# EAGLE design GameBoy-DMG-Buttons (EAGLE 7.1.0)
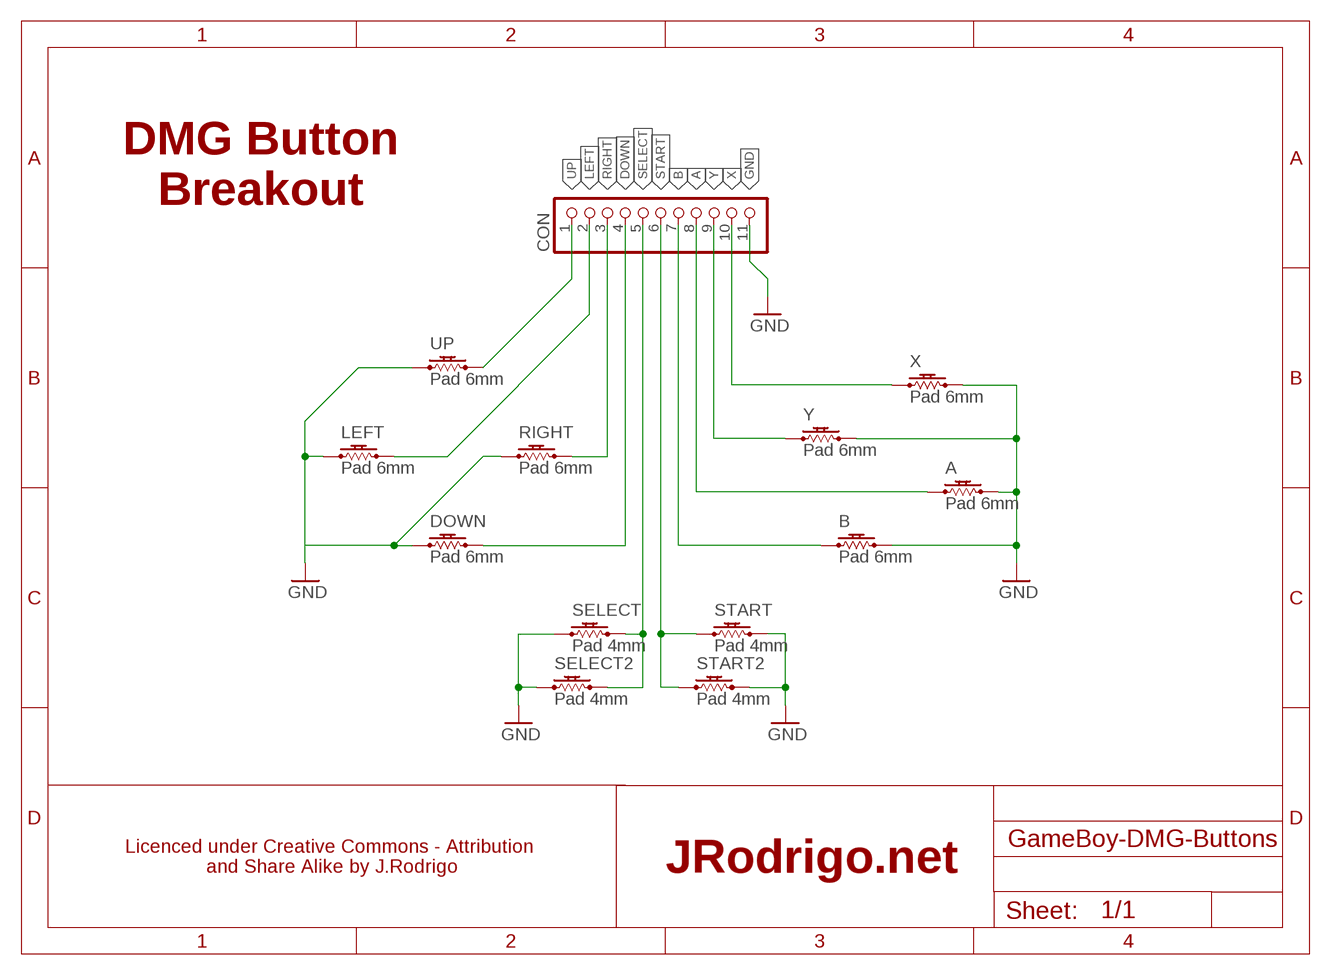
[diagram p0: schematic, sheet 1]

## Parts
A  Pad 6mm  BUTTON_PAD_6MM  [BUTTON_PAD-D6MM]
B  Pad 6mm  BUTTON_PAD_6MM  [BUTTON_PAD-D6MM]
CON  PINHD-1X11  [1X11]
DOWN  Pad 6mm  BUTTON_PAD_6MM  [BUTTON_PAD-D6MM]
LEFT  Pad 6mm  BUTTON_PAD_6MM  [BUTTON_PAD-D6MM]
RIGHT  Pad 6mm  BUTTON_PAD_6MM  [BUTTON_PAD-D6MM]
SELECT  Pad 4mm  BUTTON_PAD_4MM  [BUTTON_PAD-D4MM]
SELECT2  Pad 4mm  BUTTON_PAD_4MM  [BUTTON_PAD-D4MM]
START  Pad 4mm  BUTTON_PAD_4MM  [BUTTON_PAD-D4MM]
START2  Pad 4mm  BUTTON_PAD_4MM  [BUTTON_PAD-D4MM]
UP  Pad 6mm  BUTTON_PAD_6MM  [BUTTON_PAD-D6MM]
X  Pad 6mm  BUTTON_PAD_6MM  [BUTTON_PAD-D6MM]
Y  Pad 6mm  BUTTON_PAD_6MM  [BUTTON_PAD-D6MM]

## Nets
A: A.P1 CON.8
B: B.P1 CON.7
DOWN: CON.4 DOWN.P2
GND: A.P2 B.P2 CON.11 DOWN.P1 LEFT.P1 RIGHT.P1 SELECT2.P1 SELECT.P1 START2.P2 START.P2 UP.P1 X.P2 Y.P2
LEFT: CON.2 LEFT.P2
RIGHT: CON.3 RIGHT.P2
SELECT: CON.5 SELECT2.P2 SELECT.P2
START: CON.6 START2.P1 START.P1
UP: CON.1 UP.P2
X: CON.10 X.P1
Y: CON.9 Y.P1

## Notes on the sheet
- DMG Button
  Breakout
- Licenced under Creative Commons - Attribution 
  and Share Alike by J.Rodrigo
- JRodrigo.net

## Library data of the parts
A B DOWN LEFT RIGHT SELECT SELECT2 START START2 UP X Y = jrodrigo:BUTTON_PAD
CON = pinhead:PINHD-1X11: PIN HEADER

## Board
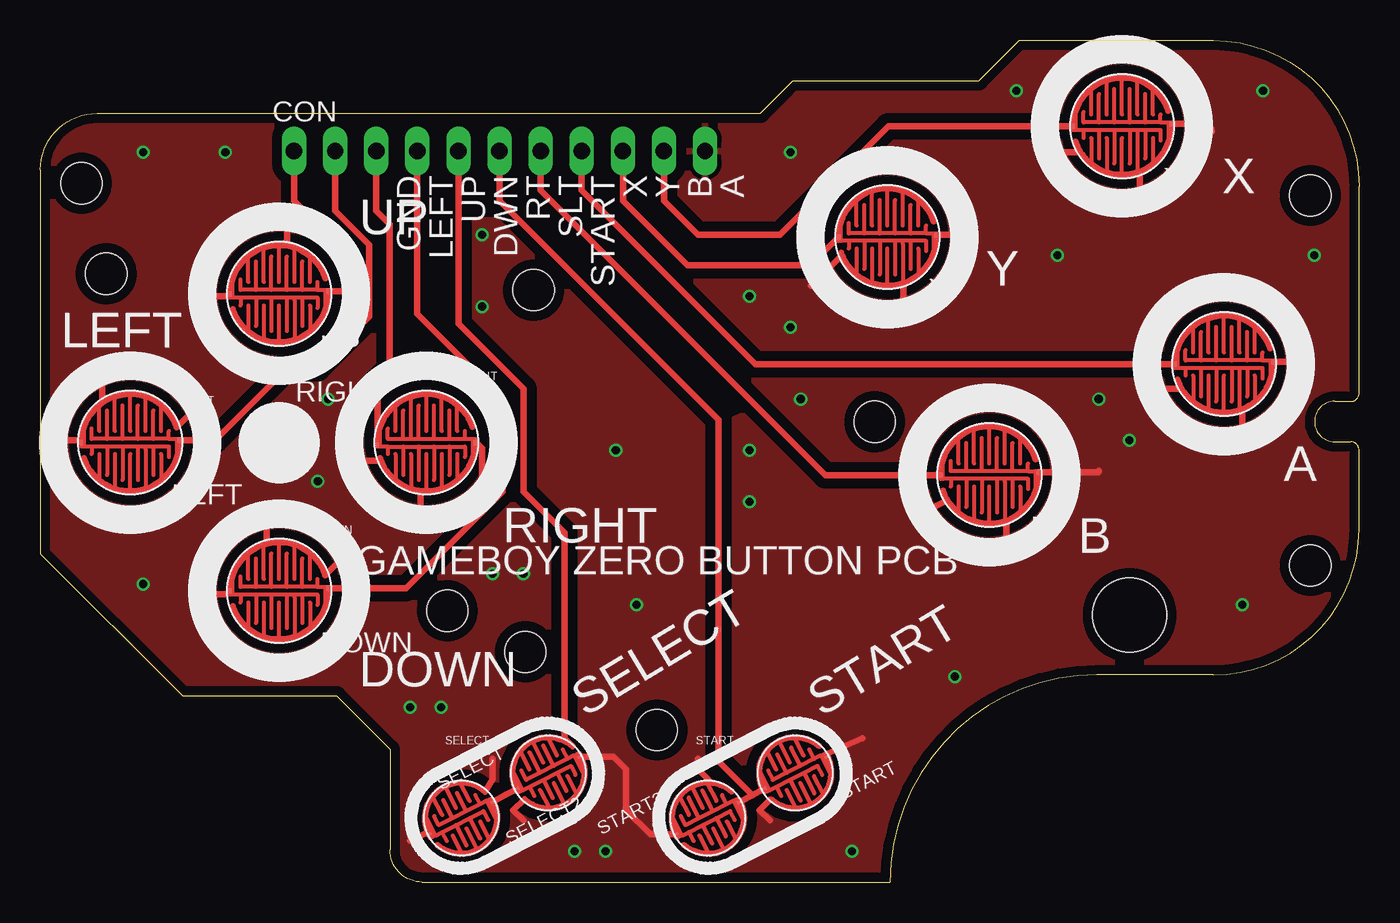
[diagram p1: board, top side]
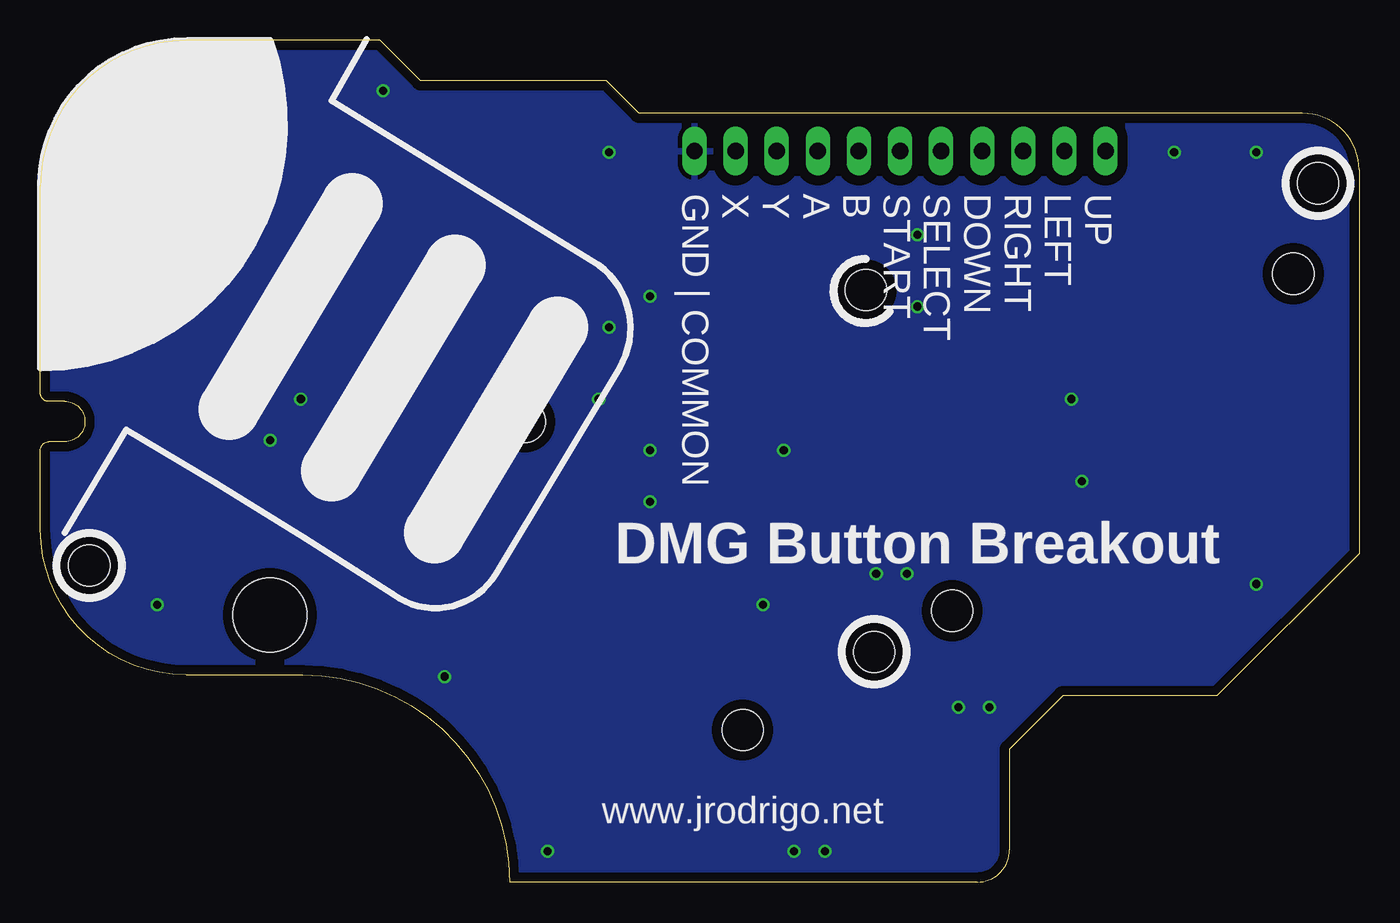
[diagram p2: board, bottom side, seen from below]

Size 81.5 x 52 mm. Coordinates in mm from the lower left corner, seen from the top.
Outline: 0,20.3 8.8,11.5 18.3,11.5 21.6,8.2 21.6,2 arc90 23.6,0 52.5,0 arc-90 65.3,12.8 72.5,12.8 arc90 81.5,21.8 81.5,26.7 arc90 81,27.2 80,27.2 arc-180 80,29.7 81,29.7 arc90 81.5,30.2 81.5,43 arc90 72.5,52 60.5,52 58,49.5 46.5,49.5 44.5,47.5 3.5,47.5 arc90 0,44 0,20.3
Copper layers (1*16): Top 0.035mm / dielectric 1.6mm / Bottom 0.035mm
Design rules "Elecrow_2-layer_PCB_eagle_rule": minimum track width 6mil, minimum drill 12mil, track to track 6mil, track to pad 6mil, pad to pad 6mil, via to via 8mil, smd to smd 0mil, copper to edge 20mil, drill to drill 10mil, minimum pad ring 6mil, minimum via ring 6mil, stop-mask expansion 0mil, vias tented up to drill 100mil, thermal gap 10mil
Holes 4.57 mm at 67.31,16.51
Holes 2.54 mm at 2.54,43.18 78.49,42.42 78.49,19.56 30.48,36.58 29.97,14.22 51.56,28.45 25.15,16.76 38.1,9.4 4.06,37.59
tRestrict: 2 lines

### Footprints (pad centres in the part's own frame; a part is rotated, then mirrored left to right if it is on the bottom)
BUTTON_PAD-D6MM = smd 0.152 x 0.305: P1 -3.016,0; P2 3.016,0.159
1X11 = drill 1.016 long: 1 -12.7,0; 2 -10.16,0; 3 -7.62,0; 4 -5.08,0; 5 -2.54,0; 6 0,0; 7 2.54,0; 8 5.08,0; 9 7.62,0; 10 10.16,0; 11 12.7,0
BUTTON_PAD-D4MM = smd 0.305 x 0.152: P1 -2.223,0; P2 2.223,0

### Placement (x,y rotation side)
A  73.15,32 0 top
B  58.65,25.15 0 top
CON  28.38,45.16 0 top
DOWN  14.75,18 0 top
LEFT  5.55,27.15 0 top
RIGHT  23.85,27.15 180 top
SELECT  31.4,6.75 207 top
SELECT2  26,3.95 27 top
START  46.65,6.75 27 top
START2  41.25,3.95 207 top
UP  14.75,36.35 0 top
X  66.85,46.7 0 top
Y  52.35,39.85 0 top

### Tracks (layer width: path | path; a pad name or v marks a point on that pad's centre or on a via)
A
  Top 0.406: CON.8 33.45,42.74 44.2,32 A.P1
B
  Top 0.406: CON.7 30.91,42.74 48.51,25.15 B.P1
DOWN
  Top 0.406: CON.4 23.3,35.12 28.57,29.84 28.57,24.13 22.6,18.16 DOWN.P2
GND  (via drill 0.5)
  Top 0.406: UP.P1 11.58,36.2 10.16,36.2 | 8.41,28.1 9.53,29.22 9.53,30.48 | 20.99,26.2 20.83,26.04 19.05,26.04 | DOWN.P1 11.51,17.78 9.53,17.78 | 17.61,18.95 18.98,20.32 19.05,20.32 | SELECT.P1 35.42,7.76 36.2,6.99 36.2,4.45 37.7,2.94 START2.P2 | Y.P2 56.52,40.01 | X.P2 71.89,46.86 arc-90 72.39,46.35 | A.P2 77.88,32.16 arc90 78.11,32.38 | B.P2 65.31,25.31 arc90 65.41,25.4 | 48.56,7.9 50.8,8.89 | 1.27,27.3 2.54,27.3 | 15.24,39.37 15.24,40.64 | 27.3,24.77 27.3,26.8 26.8,27.3 | 27.48,5.59 27.94,6.35 27.94,7.62 | 29.92,5.11 29.21,4.45 29.84,3.81 | 24.13,3.17 22.86,2.54 | 45.09,5.08 44.45,4.45 45.09,3.81 | 41.27,6.35 40.64,6.99 40.64,7.62 | 3.81,29.84 3.81,31.11 | 13.97,20.95 13.97,22.23 | 23.5,24.13 23.5,22.86 | 49.53,38.73 47.62,36.83 | 53.34,36.83 53.34,35.56 | 67.94,43.81 67.94,42.55 | 74.3,29.21 74.3,27.94 | 70.48,30.48 69.22,30.48 | 59.69,22.23 59.69,20.95 | 55.88,23.5 54.61,22.86 | 64.14,45.09 62.87,45.09
  other vias: 6.35,45.09 11.43,45.09 46.35,45.09 60.33,48.9 75.56,48.9 43.81,36.2 46.35,34.29 46.99,29.84 65.41,29.84 67.31,27.3 62.87,38.73 78.74,38.73 74.3,17.14 43.81,26.67 43.81,23.5 27.3,40.01 27.3,35.56 35.56,26.67 27.94,19.05 29.84,19.05 22.86,10.79 24.77,10.79 33.02,1.91 34.92,1.91 50.16,1.91 56.52,12.7 36.83,17.14 6.35,18.41 17.14,24.77 17.78,29.84
  pour Bottom (isolate 0.61): 0,0 81.92,0 81.92,52.07 0,52.07
  pour Top (isolate 0.61): 0,0 81.92,0 81.92,52.07 0,52.07
LEFT
  Top 0.406: CON.2 18.21,41.48 20.32,39.37 20.32,34.92 17.14,31.75 15.24,31.75 10.79,27.3 LEFT.P2
RIGHT
  Top 0.406: CON.3 20.75,41.48 21.59,40.64 21.59,31.75 20.83,30.99 RIGHT.P2
SELECT
  Top 0.406: SELECT2.P2 28.76,5.38 SELECT.P2 | CON.5 25.84,34.49 29.84,30.48 29.84,24.13 32.38,21.59 32.38,8.74 32.53,8.74 32.88,8.39
START
  Top 0.406: START2.P1 44,5.38 | 44,5.38 START.P1 | CON.6 28.38,42.11 41.91,28.57 41.91,7.46 44,5.38
UP
  Top 0.406: CON.1 15.68,42.11 19.05,38.73 19.05,36.83 18.73,36.51 UP.P2
X
  Top 0.406: CON.10 38.53,42.11 40.64,40.01 45.72,40.01 52.41,46.7 X.P1
Y
  Top 0.406: CON.9 35.99,42.11 40.01,38.1 47.58,38.1 Y.P1

### Text on the board
tPlace: X | UP | Y | LEFT | A | RIGHT | B | DOWN | SELECT | START
bPlace: UP / LEFT / RIGHT / DOWN / SELECT / START / B / A / Y / X / GND | COMMON | DMG Button Breakout | www.jrodrigo.net
tNames: X | GND | LEFT | UP | DWN | RT | SLT | START | X | Y | B | A | Y | UP | A | RIGHT | LEFT | B | DOWN | GAMEBOY ZERO BUTTON PCB | SELECT | START